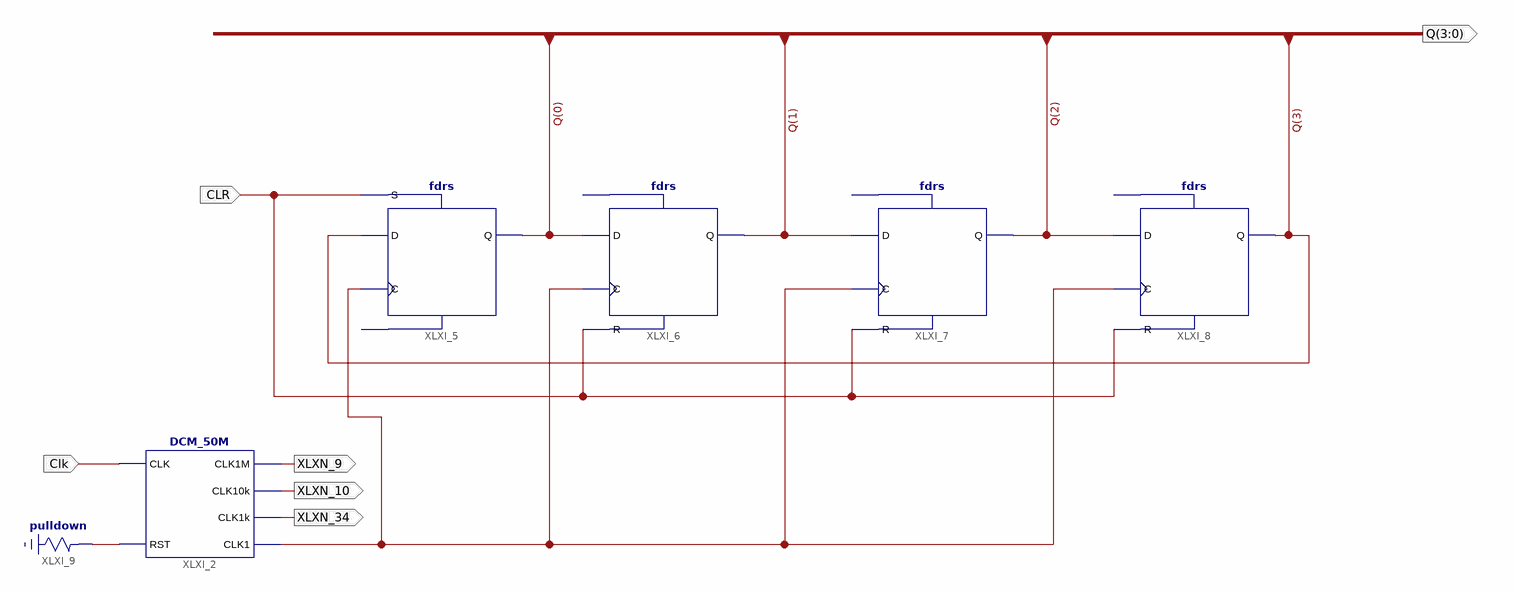
[diagram p0: schematic sheet 1]
// Xilinx ISE schematic Lab7Exp7.sch (spartan3e) as structural Verilog: 6 symbols, 6 ports
module Lab7Exp7 (
  input  Clk,
  input  CLR,
  output XLXN_9,
  output XLXN_10,
  output [3:0] Q,
  output XLXN_34
);

  wire XLXN_8, XLXN_11;

  DCM_50M XLXI_2 (.CLK(Clk), .RST(XLXN_8), .CLK1M(XLXN_9), .CLK10k(XLXN_10), .CLK1k(XLXN_34), .CLK1(XLXN_11));
  fdrs XLXI_8 (.C(XLXN_11), .D(Q[2]), .R(CLR), .Q(Q[3]));  // open: S
  fdrs XLXI_5 (.C(XLXN_11), .D(Q[3]), .S(CLR), .Q(Q[0]));  // open: R
  fdrs XLXI_6 (.C(XLXN_11), .D(Q[0]), .R(CLR), .Q(Q[1]));  // open: S
  fdrs XLXI_7 (.C(XLXN_11), .D(Q[1]), .R(CLR), .Q(Q[2]));  // open: S
  \pulldown  XLXI_9 (.O(XLXN_8));
endmodule
